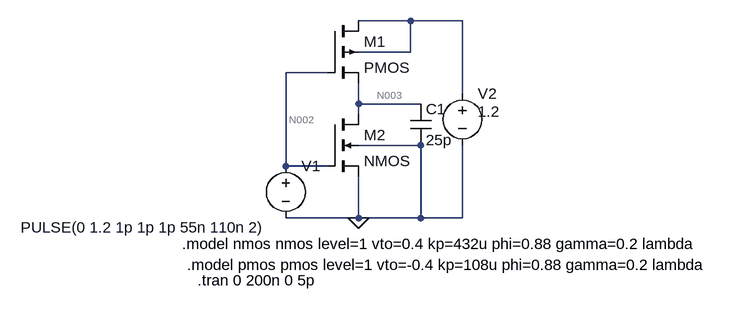
[diagram p0: schematic Lab03Pt5.asc]
Lab03Pt5.asc, the LTspice schematic file:
Version 4
SHEET 1 880 680
WIRE 272 -32 192 -32
WIRE 352 -32 272 -32
WIRE 272 16 272 -32
WIRE 272 16 192 16
WIRE 144 48 80 48
WIRE 352 80 352 -32
WIRE 192 96 192 64
WIRE 288 96 192 96
WIRE 192 112 192 96
WIRE 288 160 192 160
WIRE 80 192 80 48
WIRE 144 192 80 192
WIRE 192 272 192 208
WIRE 192 272 80 272
WIRE 288 272 288 160
WIRE 288 272 192 272
WIRE 352 272 352 160
WIRE 352 272 288 272
FLAG 192 272 0
SYMBOL voltage 80 176 R0
WINDOW 123 0 0 Left 0
WINDOW 39 0 0 Left 0
WINDOW 3 -408 110 Left 2
SYMATTR Value PULSE(0 1.2 1p 1p 1p 55n 110n 2)
SYMATTR InstName V1
SYMBOL voltage 352 64 R0
WINDOW 123 0 0 Left 0
WINDOW 39 0 0 Left 0
WINDOW 3 24 44 Left 2
SYMATTR Value 1.2
SYMATTR InstName V2
SYMBOL pmos4 144 -32 R0
SYMATTR InstName M1
SYMATTR Value2 l=0.1u w=8u
SYMBOL nmos4 144 112 R0
SYMATTR InstName M2
SYMATTR Value2 l=0.1u w=2u
SYMBOL cap 272 96 R0
SYMATTR InstName C1
SYMATTR Value 25p
TEXT -80 312 Left 2 !.model nmos nmos level=1 vto=0.4 kp=432u phi=0.88 gamma=0.2 lambda
TEXT -72 344 Left 2 !.model pmos pmos level=1 vto=-0.4 kp=108u phi=0.88 gamma=0.2 lambda
TEXT -56 368 Left 2 !.tran 0 200n 0 5p

The netlist it stands for:
* Lab03Pt5.asc
V1 N002 0 PULSE(0 1.2 1p 1p 1p 55n 110n 2)
V2 N001 0 1.2
M1 N001 N002 N003 N001 PMOS l=0.1u w=8u
M2 N003 N002 0 0 NMOS l=0.1u w=2u
C1 N003 0 25p
.model NMOS NMOS
.model PMOS PMOS
.lib standard.mos
.model nmos nmos level=1 vto=0.4 kp=432u phi=0.88 gamma=0.2 lambda
.model pmos pmos level=1 vto=-0.4 kp=108u phi=0.88 gamma=0.2 lambda
.tran 0 200n 0 5p
.backanno
.end

* Results of the author's LTspice run, read from the files saved beside the schematic
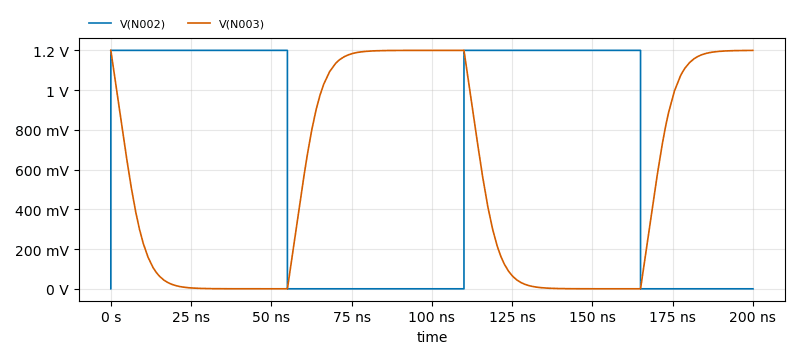
[diagram p1: Transient Analysis of Lab03Pt5.asc, plotted from the saved traces]
* Transient Analysis, 1 run:
*   V(N002): min 0 V, max 1.2 V, average 660 mV, rms 889.9 mV, last 0 V
*   V(N003): min 1.083 µV, max 1.2 V, average 540 mV, rms 758.2 mV, last 1.2 V